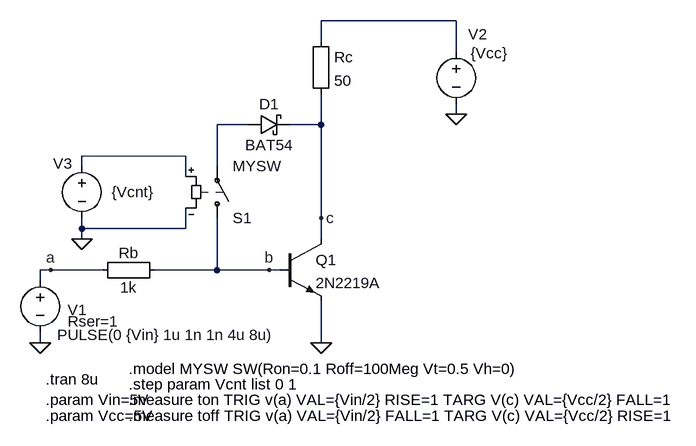
[diagram p0: schematic BJT-SWITCH-11.asc]
BJT-SWITCH-11.asc, the LTspice schematic file:
Version 4
SHEET 1 880 680
WIRE 416 -256 208 -256
WIRE 208 -224 208 -256
WIRE 416 -208 416 -256
WIRE 416 -112 416 -128
WIRE 96 -96 48 -96
WIRE 208 -96 208 -144
WIRE 208 -96 160 -96
WIRE 0 -48 -160 -48
WIRE -160 -32 -160 -48
WIRE 48 -32 48 -96
WIRE 0 -16 0 -48
WIRE 208 48 208 -96
WIRE -160 64 -160 48
WIRE 0 64 0 32
WIRE 0 64 -160 64
WIRE -160 80 -160 64
WIRE 208 80 208 48
WIRE -208 128 -224 128
WIRE -128 128 -208 128
WIRE 48 128 48 48
WIRE 48 128 -48 128
WIRE 128 128 48 128
WIRE 144 128 128 128
WIRE -224 144 -224 128
WIRE -224 240 -224 224
WIRE 208 240 208 176
FLAG 208 240 0
FLAG -224 240 0
FLAG 416 -112 0
FLAG -208 128 a
FLAG 208 48 c
FLAG 128 128 b
FLAG -160 80 0
SYMBOL Misc\\EuropeanResistor 192 -240 R0
SYMATTR InstName Rc
SYMATTR Value 50
SYMBOL Misc\\EuropeanResistor -32 112 R90
WINDOW 0 5 56 VBottom 2
WINDOW 3 27 56 VTop 2
SYMATTR InstName Rb
SYMATTR Value 1k
SYMBOL voltage -224 128 R0
WINDOW 3 26 100 Left 2
WINDOW 123 0 0 Left 2
WINDOW 39 42 79 Left 2
WINDOW 0 42 61 Left 2
SYMATTR Value PULSE(0 {Vin} 1u 1n 1n 4u 8u)
SYMATTR SpiceLine Rser=1
SYMATTR InstName V1
SYMBOL voltage 416 -224 R0
WINDOW 3 22 18 Left 2
WINDOW 123 0 0 Left 2
WINDOW 39 0 0 Left 2
WINDOW 0 18 -11 Left 2
SYMATTR Value {Vcc}
SYMATTR InstName V2
SYMBOL npn 144 80 R0
SYMATTR InstName Q1
SYMATTR Value 2N2219A
SYMBOL voltage -160 -48 R0
WINDOW 0 -44 12 Left 2
WINDOW 3 46 56 Left 2
WINDOW 123 0 0 Left 0
WINDOW 39 0 0 Left 0
SYMATTR InstName V3
SYMATTR Value {Vcnt}
SYMBOL sw 48 64 M180
SYMATTR InstName S1
SYMATTR Value MYSW
SYMBOL schottky 96 -80 R270
WINDOW 0 32 32 VTop 2
WINDOW 3 0 32 VBottom 2
SYMATTR InstName D1
SYMATTR Value BAT54
SYMATTR Description Diode
SYMATTR Type diode
TEXT -216 296 Left 2 !.tran 8u
TEXT -216 328 Left 2 !.param Vin=5V
TEXT -88 352 Left 2 !.measure toff TRIG v(a) VAL={Vin/2} FALL=1 TARG V(c) VAL={Vcc/2} RISE=1
TEXT -216 352 Left 2 !.param Vcc=5V
TEXT -88 328 Left 2 !.measure ton TRIG v(a) VAL={Vin/2} RISE=1 TARG V(c) VAL={Vcc/2} FALL=1
TEXT -88 304 Left 2 !.step param Vcnt list 0 1
TEXT -88 280 Left 2 !.model MYSW SW(Ron=0.1 Roff=100Meg Vt=0.5 Vh=0)

The netlist it stands for:
* BJT-SWITCH-11.asc
Rc N001 c 50
Rb b a 1k
V1 a 0 PULSE(0 {Vin} 1u 1n 1n 4u 8u) Rser=1
V2 N001 0 {Vcc}
Q1 c b 0 0 2N2219A
V3 N003 0 {Vcnt}
S1 b N002 N003 0 MYSW
D1 N002 c BAT54
.model D D
.lib standard.dio
.model NPN NPN
.model PNP PNP
.lib standard.bjt
.tran 8u
.param Vin=5V
.measure toff TRIG v(a) VAL={Vin/2} FALL=1 TARG V(c) VAL={Vcc/2} RISE=1
.param Vcc=5V
.measure ton TRIG v(a) VAL={Vin/2} RISE=1 TARG V(c) VAL={Vcc/2} FALL=1
.step param Vcnt list 0 1
.model MYSW SW(Ron=0.1 Roff=100Meg Vt=0.5 Vh=0)
.backanno
.end